# EAGLE design DiffVer (EAGLE 9.6.2)

## Sheet 1 of 2
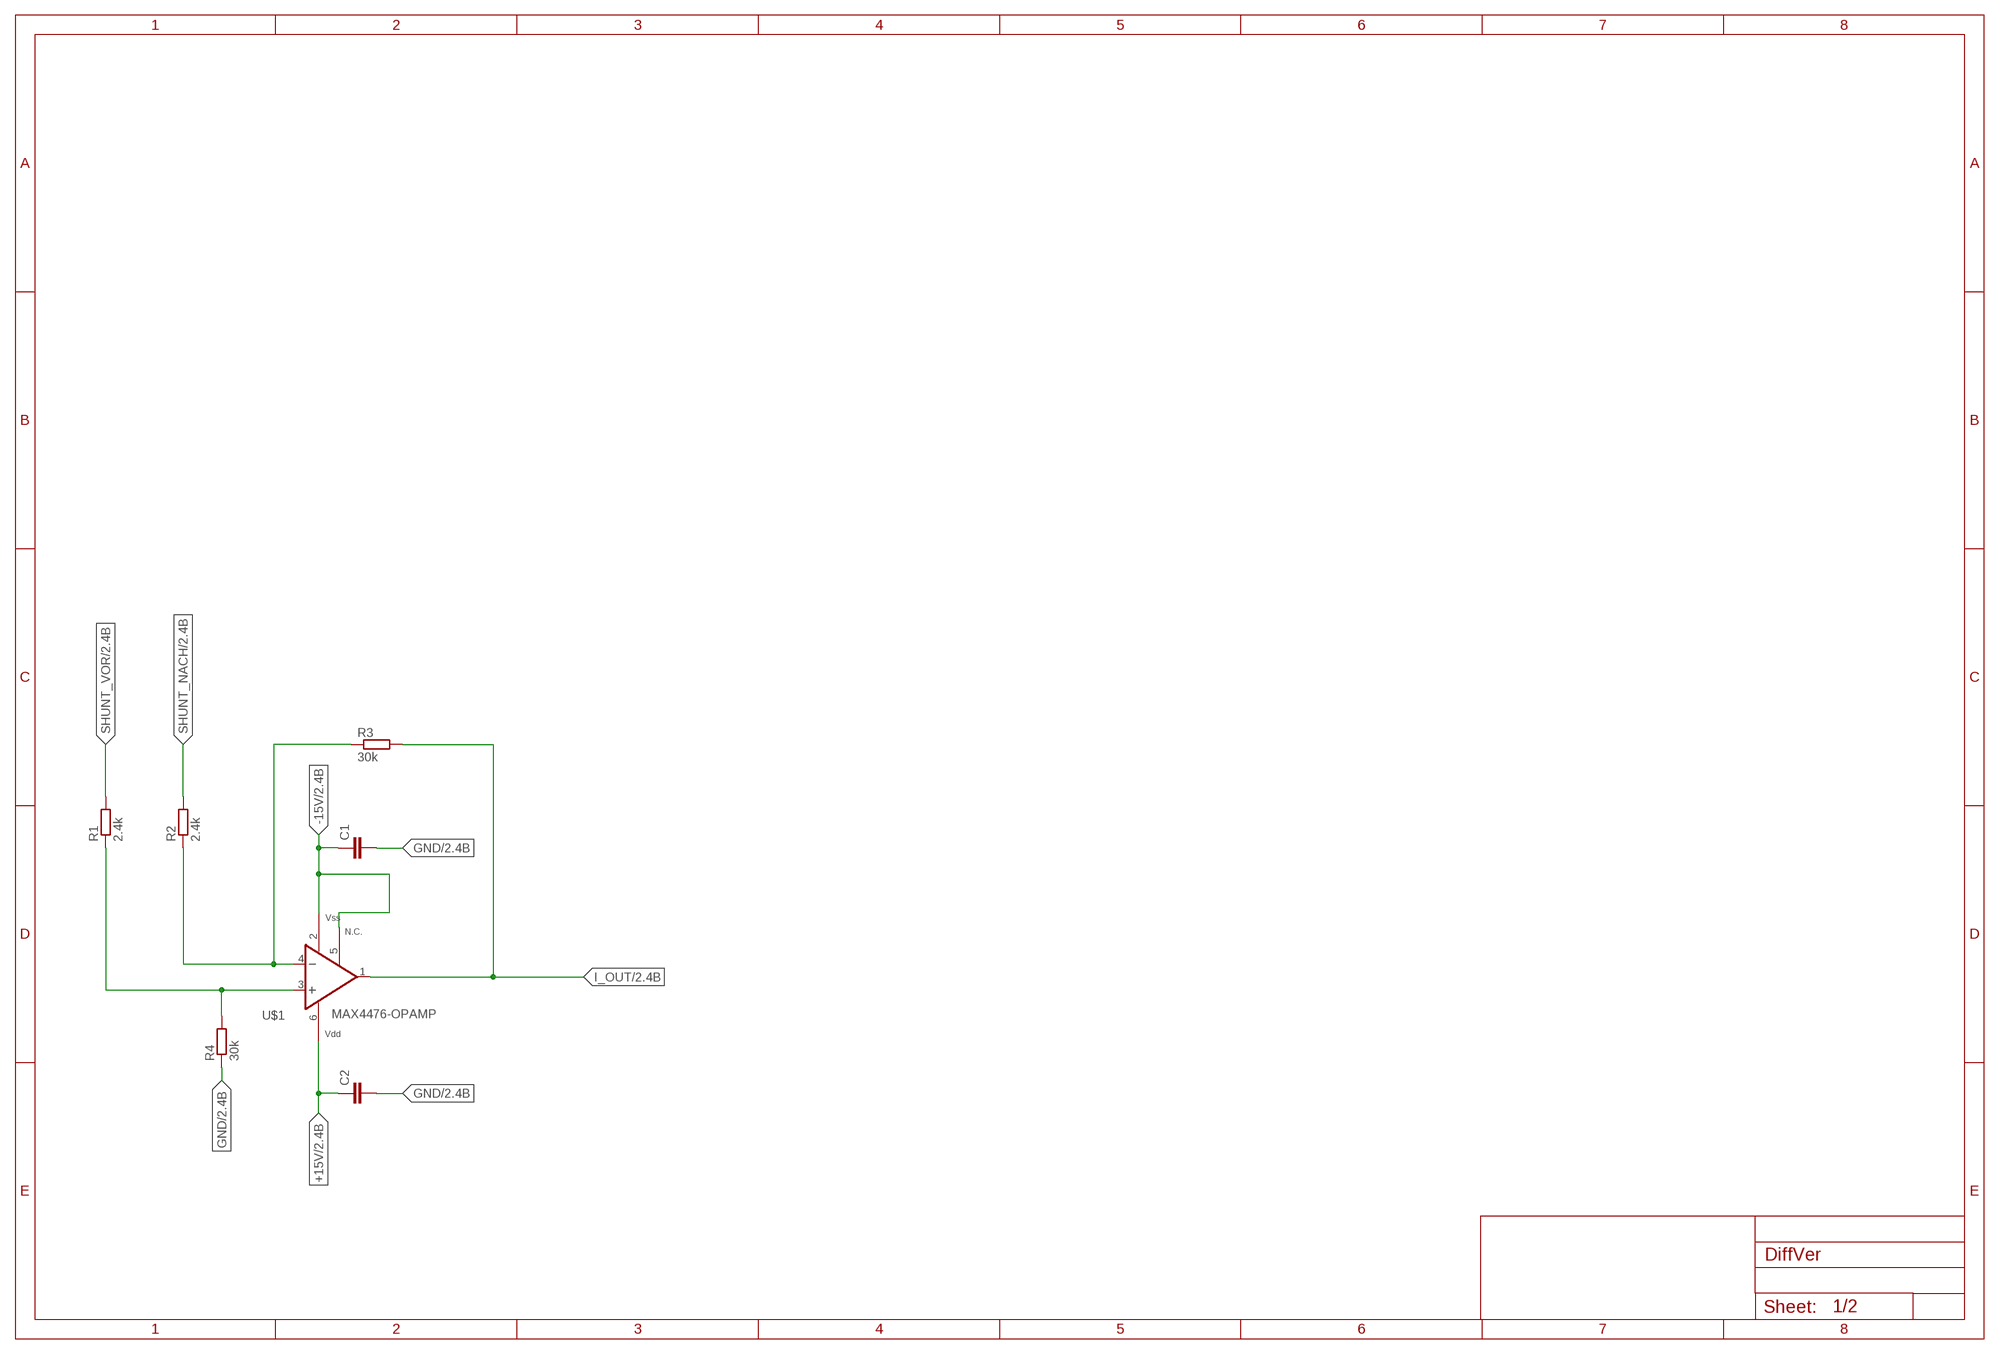
[diagram p0: schematic, sheet 1]

### Parts
C1  C-EUC0805  [C0805]
C2  C-EUC0805  [C0805]
R1  2.4k  R-EU_R0805  [R0805]
R2  2.4k  R-EU_R0805  [R0805]
R3  30k  R-EU_R0805  [R0805]
R4  30k  R-EU_R0805  [R0805]
U$1  MAX4476-OPAMP  [SOT23-6]

### Nets
+15V: C2.1 U$1.6(VDD) ; also sheet 2
-15V: C1.1 U$1.2(VSS) U$1.5(NC) ; also sheet 2
GND: C1.2 C2.2 R4.1 ; also sheet 2
I_OUT: R3.2 U$1.1(OUT) ; also sheet 2
MINUS_OP: R2.1 R3.1 U$1.4(-IN)
PLUS_OP: R1.1 R4.2 U$1.3(+IN)
SHUNT_NACH: R2.2 ; also sheet 2
SHUNT_VOR: R1.2 ; also sheet 2

## Sheet 2 of 2
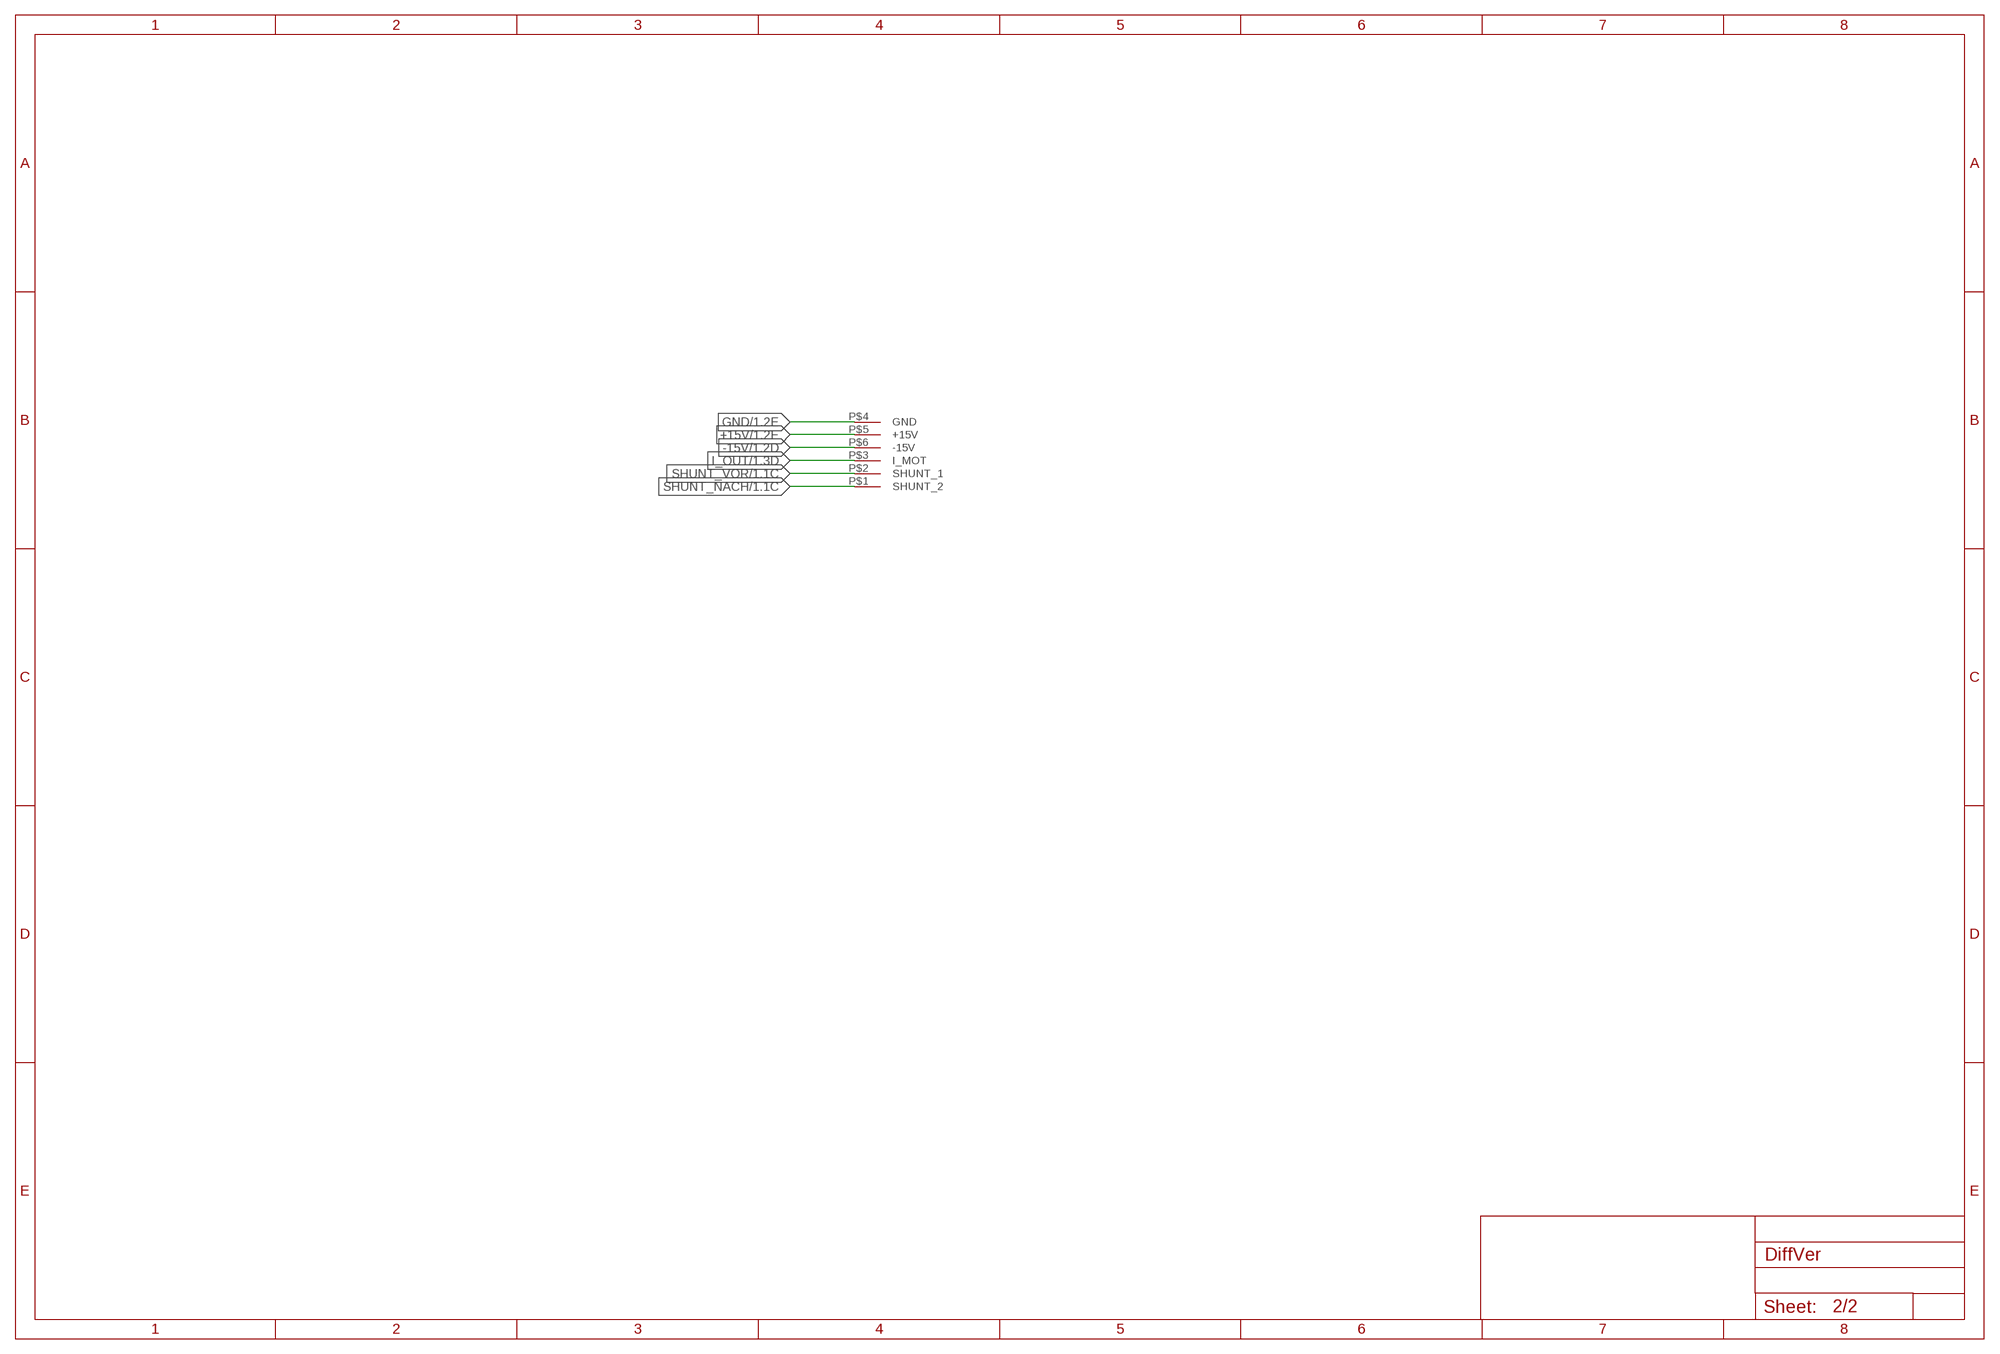
[diagram p1: schematic, sheet 2]

### Parts
U$2  ADAPTERPLATINE_OPSHUNT  [ADAPTERPLATINE_OPSHUNT]

### Nets
+15V: U$2.P$5(+15V) ; also sheet 1
-15V: U$2.P$6(-15V) ; also sheet 1
GND: U$2.P$4(GND) ; also sheet 1
I_OUT: U$2.P$3(I_MOT) ; also sheet 1
SHUNT_NACH: U$2.P$1(SHUNT_2) ; also sheet 1
SHUNT_VOR: U$2.P$2(SHUNT_1) ; also sheet 1

## Library data of the parts
C1 C2 = rcl:C-EU: CAPACITOR, European symbol; SPICEPREFIX: C
R1-R4 = rcl:R-EU_: RESISTOR, European symbol; SPICEPREFIX: R
U$1 = gele_maximopamps_44xx:MAX4476-OPAMP: MAX4476 Low-Noise, Low-Distortion, Wide-Band, Rail-to-Rail Op Amp These amplifier has rail-to-rail output. It's input common-mode voltage range includes ground. The MAX4476 is unity-gain stable with a gain-bandwidth product of 10MHz. Features: ♦ Low Input Voltage-Noise Density: 4.5nV/√Hz ♦ Low Input Current-Noise Density: 0.5fA/√Hz ♦ Low Distortion: 0.0002% THD+N (1kΩ load) ♦ Single-Supply Operation from +2.7V to +5.5V source used: http://www.farnell.com/datasheets/28851.pdf
U$2 = Adapterplatine_OPShunt:ADAPTERPLATINE_OPSHUNT

## Net classes
0 default: width 0.61 mm, clearance 0.305 mm

## Board
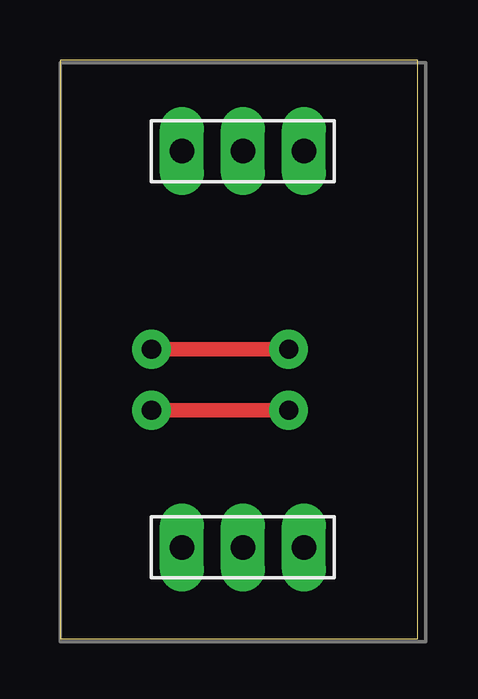
[diagram p2: board, top side]
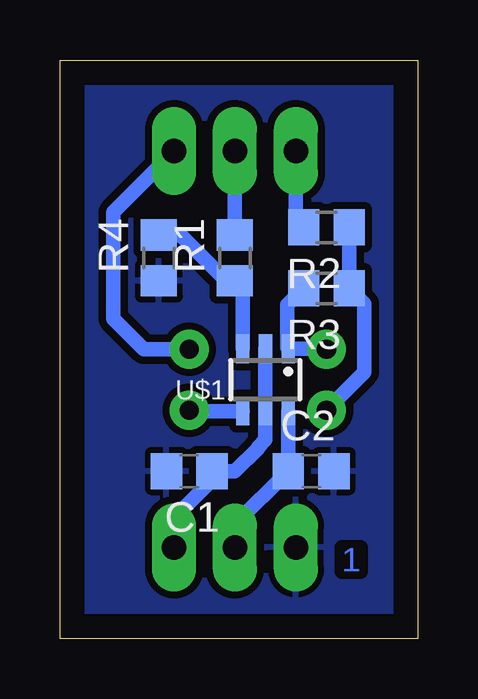
[diagram p3: board, bottom side, seen from below]

Size 14.91 x 24.12 mm. Coordinates in mm from the lower left corner, seen from the top.
Outline: 0,0 14.91,0 14.91,24.12 0,24.12 0,0
Copper layers (1*16): Top 0.035mm / dielectric 1.5mm / Bottom 0.035mm
Design rules "default *": minimum track width 6mil, minimum drill 0.35mm, track to track 6mil, track to pad 6mil, pad to pad 6mil, via to via 6mil, smd to smd 6mil, copper to edge 40mil, drill to drill 6mil, minimum pad ring 16mil, minimum via ring 16mil, stop-mask expansion 4mil, vias tented up to drill 0mil, thermal gap 10mil

### Footprints (pad centres in the part's own frame; a part is rotated, then mirrored left to right if it is on the bottom)
C0805 = smd 1.3 x 1.5: 1 -0.95,0; 2 0.95,0
R0805 = smd 1.3 x 1.5: 1 -0.95,0; 2 0.95,0
SOT23-6 = smd 0.55 x 1.2: 1 -0.95,-1.3; 2 0,-1.3; 3 0.95,-1.3; 4 0.95,1.3; 5 0,1.3; 6 -0.95,1.3
ADAPTERPLATINE_OPSHUNT = drill 1.02 long: P$1 0,3.81; P$2 2.54,3.81; P$3 5.08,3.81; P$4 0,-12.7; P$5 2.54,-12.7; P$6 5.08,-12.7

### Placement (x,y rotation side)
C1  9.53,6.99 180 bottom
C2  4.45,6.99 0 bottom
R1  7.62,15.88 90 bottom
R2  3.81,17.14 180 bottom
R3  3.81,14.61 180 bottom
R4  10.79,15.88 90 bottom
U$1  6.35,10.79 180 bottom
U$2  5.08,16.51 0 top

### Tracks (layer width: path | path; a pad name or v marks a point on that pad's centre or on a via)
+15V
  Bottom 0.61: U$1.6 C2.1 | C2.1 | C2.1 7.62,4.77 U$2.P$5
-15V
  Bottom 0.61: U$1.2 U$1.5 6.35,8.29 6.66,7.99 6.66,7.95 7.62,6.99 C1.1 8.57,6.62 10.16,5.04 U$2.P$6
GND
  pour Bottom: 0,24.13 15.24,24.13 15.24,0 0,0
I_OUT  (via drill 0.8)
  Top 0.61: v3.81,12.06 v9.53,12.06
  Bottom 0.61: R3.2 5.44,13.93 5.44,12.13 U$1.1 3.84,12.1 v3.81,12.06 | v9.53,12.06 11.43,12.06 12.7,13.34 12.7,17.78 U$2.P$3
MINUS_OP  (via drill 0.8)
  Top 0.61: v3.81,9.53 v9.53,9.53
  Bottom 0.61: R2.1 R3.1 2.23,13.97 2.23,11.11 v3.81,9.53 | v9.53,9.53 9.49,9.49 U$1.4
PLUS_OP
  Bottom 0.61: U$1.3 7.3,14.61 R1.1 7.98,14.93 9.88,16.82 R4.2
SHUNT_NACH
  Bottom 0.61: U$2.P$1 5.08,17.46 R2.2
SHUNT_VOR
  Bottom 0.61: U$2.P$2 R1.2

### Text on the board
Bottom: 1